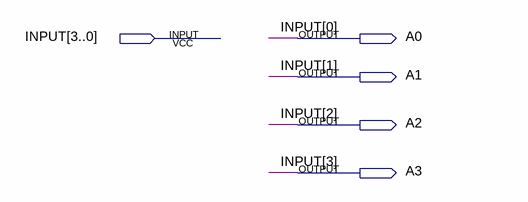
[diagram p0: schematic sheet]
// Quartus schematic BusDecoder.bdf as structural Verilog: 0 symbols, 5 pins
module BusDecoder (
  input  [3:0] INPUT,
  output A0,
  output A1,
  output A2,
  output A3
);


  assign A0 = INPUT[0];
  assign A1 = INPUT[1];
  assign A2 = INPUT[2];
  assign A3 = INPUT[3];
endmodule
